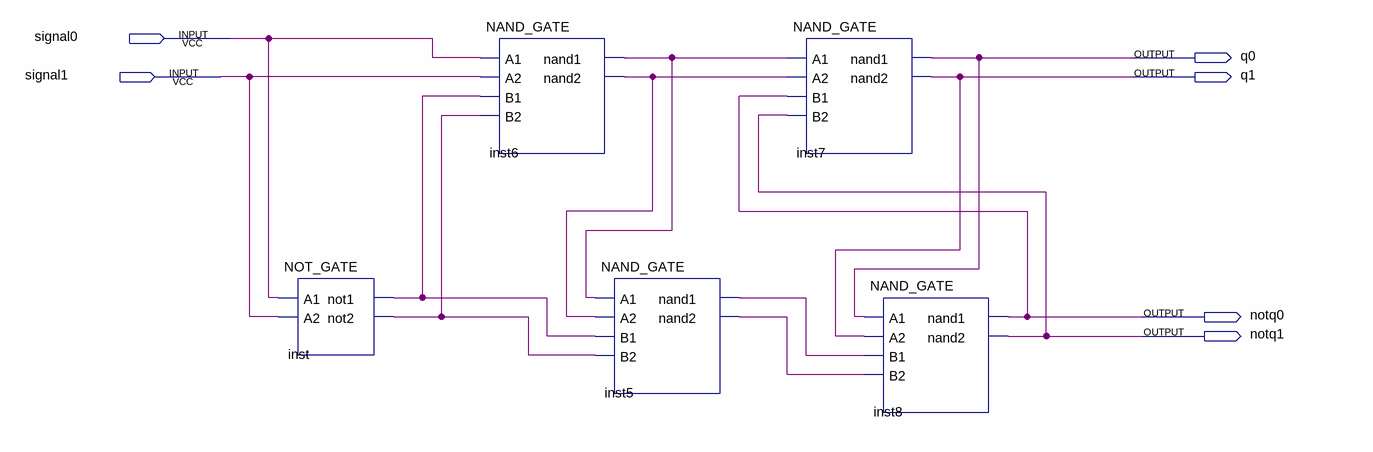
[diagram p0: schematic sheet]
// Quartus schematic latch.bdf as structural Verilog: 5 symbols, 6 pins
module latch (
  input  signal0,
  input  signal1,
  output q0,
  output q1,
  output notq0,
  output notq1
);

  wire inst5_nand1, inst5_nand2, inst6_nand1, inst6_nand2, inst_not1, inst_not2;

  NOT_GATE inst (.A1(signal0), .A2(signal1), .not1(inst_not1), .not2(inst_not2));
  NAND_GATE inst6 (
    .A1(signal0), .A2(signal1), .B1(inst_not1), .B2(inst_not2), .nand1(inst6_nand1), .nand2(inst6_nand2));
  NAND_GATE inst5 (
    .A1(inst6_nand1), .A2(inst6_nand2), .B1(inst_not1), .B2(inst_not2), .nand1(inst5_nand1),
    .nand2(inst5_nand2));
  NAND_GATE inst7 (.A1(inst6_nand1), .A2(inst6_nand2), .B1(notq0), .B2(notq1), .nand1(q0), .nand2(q1));
  NAND_GATE inst8 (.A1(q0), .A2(q1), .B1(inst5_nand1), .B2(inst5_nand2), .nand1(notq0), .nand2(notq1));
endmodule
